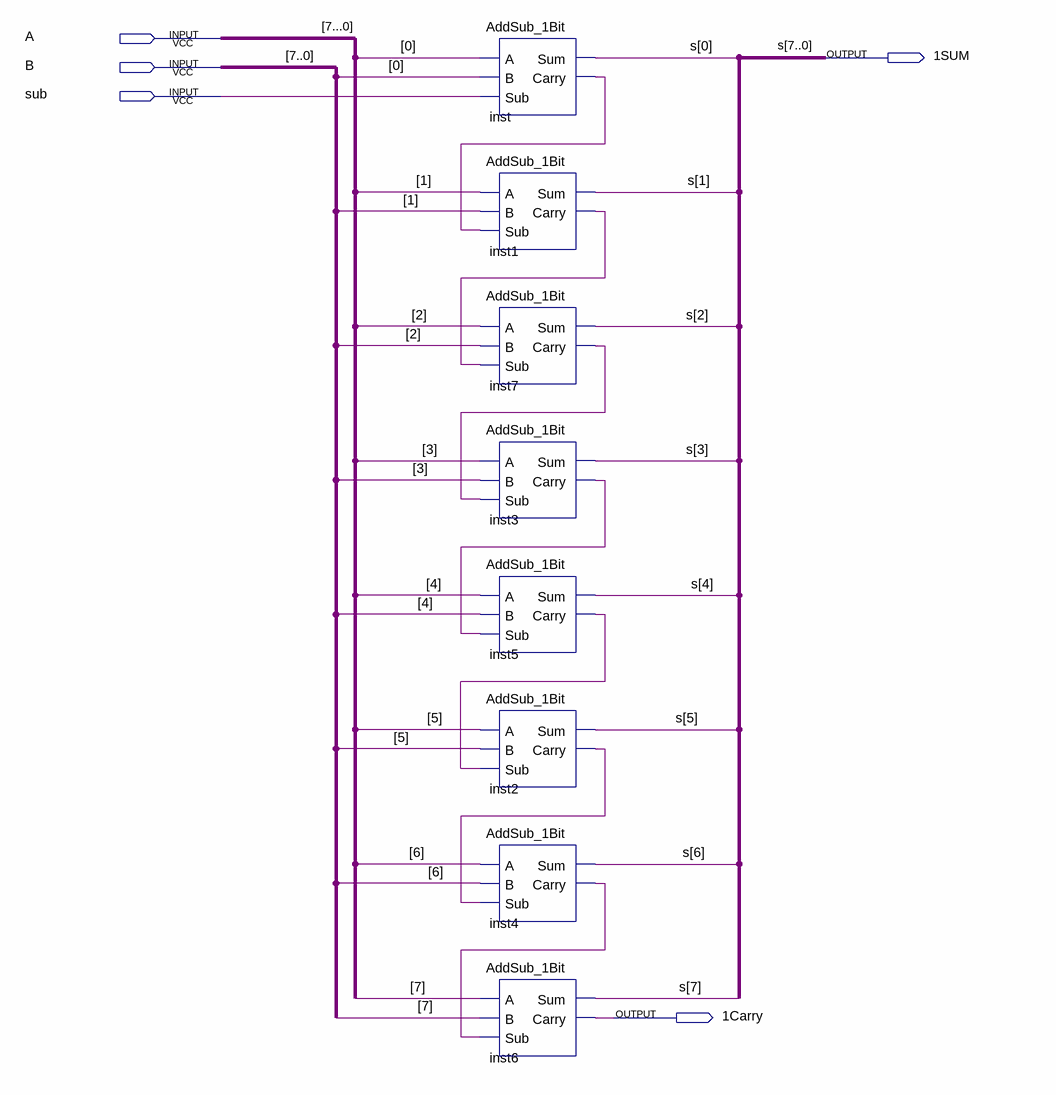
[diagram p0: schematic sheet]
// Quartus schematic First8Bit_AddSub.bdf as structural Verilog: 8 symbols, 5 pins
module First8Bit_AddSub (
  input  A,
  input  B,
  input  sub,
  output \1SUM ,
  output \1Carry 
);

  wire inst1_carry, inst2_carry, inst3_carry, inst4_carry, inst5_carry, inst7_carry, inst_carry;
  wire [7:0] s;

  AddSub_1Bit inst (.A(A), .B(B), .Sub(sub), .Sum(s[0]), .Carry(inst_carry));
  AddSub_1Bit inst1 (.A(A), .B(B), .Sub(inst_carry), .Sum(s[1]), .Carry(inst1_carry));
  AddSub_1Bit inst7 (.A(A), .B(B), .Sub(inst1_carry), .Sum(s[2]), .Carry(inst7_carry));
  AddSub_1Bit inst3 (.A(A), .B(B), .Sub(inst7_carry), .Sum(s[3]), .Carry(inst3_carry));
  AddSub_1Bit inst5 (.A(A), .B(B), .Sub(inst3_carry), .Sum(s[4]), .Carry(inst5_carry));
  AddSub_1Bit inst2 (.A(A), .B(B), .Sub(inst5_carry), .Sum(s[5]), .Carry(inst2_carry));
  AddSub_1Bit inst4 (.A(A), .B(B), .Sub(inst2_carry), .Sum(s[6]), .Carry(inst4_carry));
  AddSub_1Bit inst6 (.A(A), .B(B), .Sub(inst4_carry), .Sum(s[7]), .Carry(\1Carry ));

  // Other names for the same wires on the sheet: [7...0] = A
endmodule
